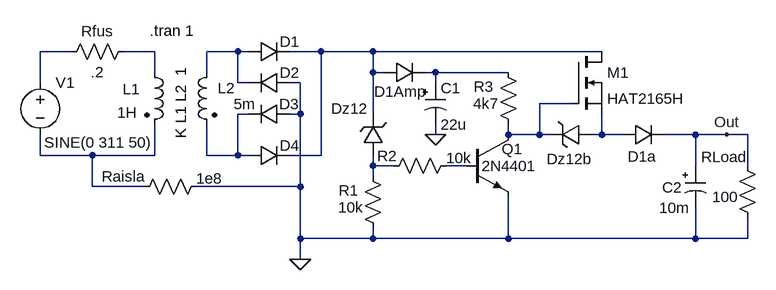
[diagram p0: schematic MosFetSw.asc]
MosFetSw.asc, the LTspice schematic file:
Version 4
SHEET 1 940 680
WIRE -128 96 -176 96
WIRE 0 96 -48 96
WIRE 128 96 80 96
WIRE 144 96 128 96
WIRE 256 96 208 96
WIRE 336 96 256 96
WIRE 688 96 336 96
WIRE 0 128 0 96
WIRE 80 128 80 96
WIRE 336 128 336 96
WIRE 352 128 336 128
WIRE 432 128 416 128
WIRE 544 128 432 128
WIRE -176 144 -176 96
WIRE 128 144 128 96
WIRE 144 144 128 144
WIRE 224 144 208 144
WIRE 432 144 432 128
WIRE 640 176 592 176
WIRE 144 192 128 192
WIRE 224 192 224 144
WIRE 224 192 208 192
WIRE 336 192 336 128
WIRE 432 224 432 208
WIRE 544 224 544 208
WIRE 592 224 592 176
WIRE 592 224 544 224
WIRE 608 224 592 224
WIRE 688 224 688 192
WIRE 688 224 672 224
WIRE 720 224 688 224
WIRE 832 224 784 224
WIRE 880 224 832 224
WIRE 912 224 880 224
WIRE -176 256 -176 224
WIRE -96 256 -176 256
WIRE 0 256 0 208
WIRE 0 256 -96 256
WIRE 80 256 80 208
WIRE 128 256 128 192
WIRE 128 256 80 256
WIRE 144 256 128 256
WIRE 256 256 256 96
WIRE 256 256 208 256
WIRE 336 272 336 256
WIRE 368 272 336 272
WIRE 480 272 448 272
WIRE 832 272 832 224
WIRE 912 272 912 224
WIRE 336 288 336 272
WIRE -96 304 -96 256
WIRE -16 304 -96 304
WIRE 224 304 224 192
WIRE 224 304 64 304
WIRE 224 384 224 304
WIRE 336 384 336 368
WIRE 336 384 224 384
WIRE 544 384 544 320
WIRE 544 384 336 384
WIRE 832 384 832 336
WIRE 832 384 544 384
WIRE 912 384 912 352
WIRE 912 384 832 384
WIRE 224 416 224 384
FLAG 224 416 0
FLAG 432 224 0
FLAG 880 224 Out
SYMBOL res -32 80 R90
WINDOW 0 0 56 VBottom 0
WINDOW 3 32 56 VTop 0
SYMATTR InstName Rfus
SYMATTR Value .2
SYMATTR SpiceLine tol=1 pwr=0.1
SYMBOL diode 144 112 R270
WINDOW 0 16 64 VTop 0
WINDOW 3 0 32 Invisible 0
SYMATTR InstName D1
SYMATTR Value MURS320
SYMBOL diode 208 160 M270
WINDOW 0 16 0 VTop 0
WINDOW 3 0 32 Invisible 0
SYMATTR InstName D2
SYMATTR Value MURS320
SYMBOL diode 208 208 M270
WINDOW 0 16 1 VTop 0
WINDOW 3 0 32 Invisible 0
SYMATTR InstName D3
SYMATTR Value MURS320
SYMBOL diode 144 272 R270
WINDOW 0 16 64 VTop 0
WINDOW 3 0 32 Invisible 0
SYMATTR InstName D4
SYMATTR Value MURS320
SYMBOL ind2 -16 112 R0
WINDOW 0 -33 42 Left 0
WINDOW 3 -42 78 Left 0
SYMATTR InstName L1
SYMATTR Value 1H
SYMATTR SpiceLine Rser=1
SYMBOL ind2 96 112 M0
WINDOW 0 -28 40 Left 0
WINDOW 3 -59 65 Left 0
SYMATTR InstName L2
SYMATTR Value 5m
SYMATTR SpiceLine Rser=.01
SYMBOL voltage -176 128 R0
WINDOW 3 6 108 Left 0
WINDOW 123 0 0 Left 0
WINDOW 39 0 0 Left 0
SYMATTR Value SINE(0 311 50)
SYMATTR InstName V1
SYMBOL res 80 288 R90
WINDOW 0 16 128 VBottom 0
WINDOW 3 -12 -4 VTop 0
SYMATTR InstName Raisla
SYMATTR Value 1e8
SYMATTR SpiceLine tol=1 pwr=0.1
SYMBOL zener 352 256 R180
WINDOW 0 24 72 Left 0
WINDOW 3 24 0 Invisible 0
SYMATTR InstName Dz12
SYMATTR Value BZX84C12L
SYMBOL diode 352 144 R270
WINDOW 0 -29 26 VTop 0
WINDOW 3 0 51 Invisible 0
SYMATTR InstName D1Amp
SYMATTR Value MURS120
SYMBOL res 320 272 R0
WINDOW 0 -37 38 Left 0
WINDOW 3 -38 64 Left 0
SYMATTR InstName R1
SYMATTR Value 10k
SYMBOL res 464 256 R90
WINDOW 0 16 106 VBottom 0
WINDOW 3 -12 -4 VTop 0
SYMATTR InstName R2
SYMATTR Value 10k
SYMATTR SpiceLine tol=1 pwr=0.1
SYMBOL npn2 480 224 R0
WINDOW 0 54 22 Left 0
WINDOW 3 23 48 Left 0
SYMATTR InstName Q1
SYMATTR Value 2N4401
SYMBOL polcap 416 144 R0
WINDOW 3 24 64 Left 0
SYMATTR Value 22u
SYMATTR InstName C1
SYMATTR Description Capacitor
SYMATTR Type cap
SYMATTR SpiceLine V=35 Irms=160m Rser=0.75 MTBF=2000 Lser=0 mfg="Nichicon" pn="UPL1V220MAH" type="Al electrolytic" ppPkg=1
SYMBOL res 528 112 R0
WINDOW 0 -37 38 Left 0
WINDOW 3 -38 64 Left 0
SYMATTR InstName R3
SYMATTR Value 4k7
SYMBOL zener 672 208 R90
WINDOW 0 69 34 VBottom 0
WINDOW 3 36 32 Invisible 0
SYMATTR InstName Dz12b
SYMATTR Value BZX84C12L
SYMBOL nmos 640 96 R0
SYMATTR InstName M1
SYMATTR Value HAT2165H
SYMBOL diode 720 240 R270
WINDOW 0 -33 30 VTop 0
WINDOW 3 0 51 Invisible 0
SYMATTR InstName D1a
SYMATTR Value MURS120
SYMBOL polcap 816 272 R0
WINDOW 0 -35 33 Left 0
WINDOW 3 -40 65 Left 0
SYMATTR InstName C2
SYMATTR Value 10m
SYMATTR Description Capacitor
SYMATTR Type cap
SYMATTR SpiceLine V=16 Irms=1.41 Rser=0.047 MTBF=5000 Lser=0 mfg="Nichicon" pn="UPL1C102MPH" type="Al electrolytic" ppPkg=1
SYMBOL res 896 256 R0
WINDOW 0 -55 2 Left 0
WINDOW 3 -38 64 Left 0
SYMATTR InstName RLoad
SYMATTR Value 100
TEXT 40 120 VRight 0 !K L1 L2  1
TEXT -8 64 Left 0 !.tran 1

The netlist it stands for:
* MosFetSw.asc
Rfus N002 N001 .2 tol=1 pwr=0.1
D1 N003 N004 MURS320
D2 0 N003 MURS320
D3 0 N007 MURS320
D4 N007 N004 MURS320
L1 N002 N009 1H Rser=1
L2 N003 N007 5m Rser=.01
V1 N001 N009 SINE(0 311 50)
Raisla 0 N009 1e8 tol=1 pwr=0.1
Dz12 N010 N004 BZX84C12L
D1Amp N004 N005 MURS120
R1 N010 0 10k
R2 N011 N010 10k tol=1 pwr=0.1
Q1 N006 N011 0 0 2N4401
C1 N005 0 22u V=35 Irms=160m Rser=0.75 MTBF=2000 Lser=0 mfg="Nichicon" pn="UPL1V220MAH" type="Al electrolytic" ppPkg=1
R3 N005 N006 4k7
Dz12b N008 N006 BZX84C12L
M1 N004 N006 N008 N008 HAT2165H
D1a N008 Out MURS120
C2 Out 0 10m V=16 Irms=1.41 Rser=0.047 MTBF=5000 Lser=0 mfg="Nichicon" pn="UPL1C102MPH" type="Al electrolytic" ppPkg=1
RLoad Out 0 100
.model D D
.lib standard.dio
.model NPN NPN
.model PNP PNP
.lib standard.bjt
.model NMOS NMOS
.model PMOS PMOS
.lib standard.mos
K L1 L2  1
.tran 1
.backanno
.end